# EAGLE schematic CurrentMeter (EAGLE 9.4.1)
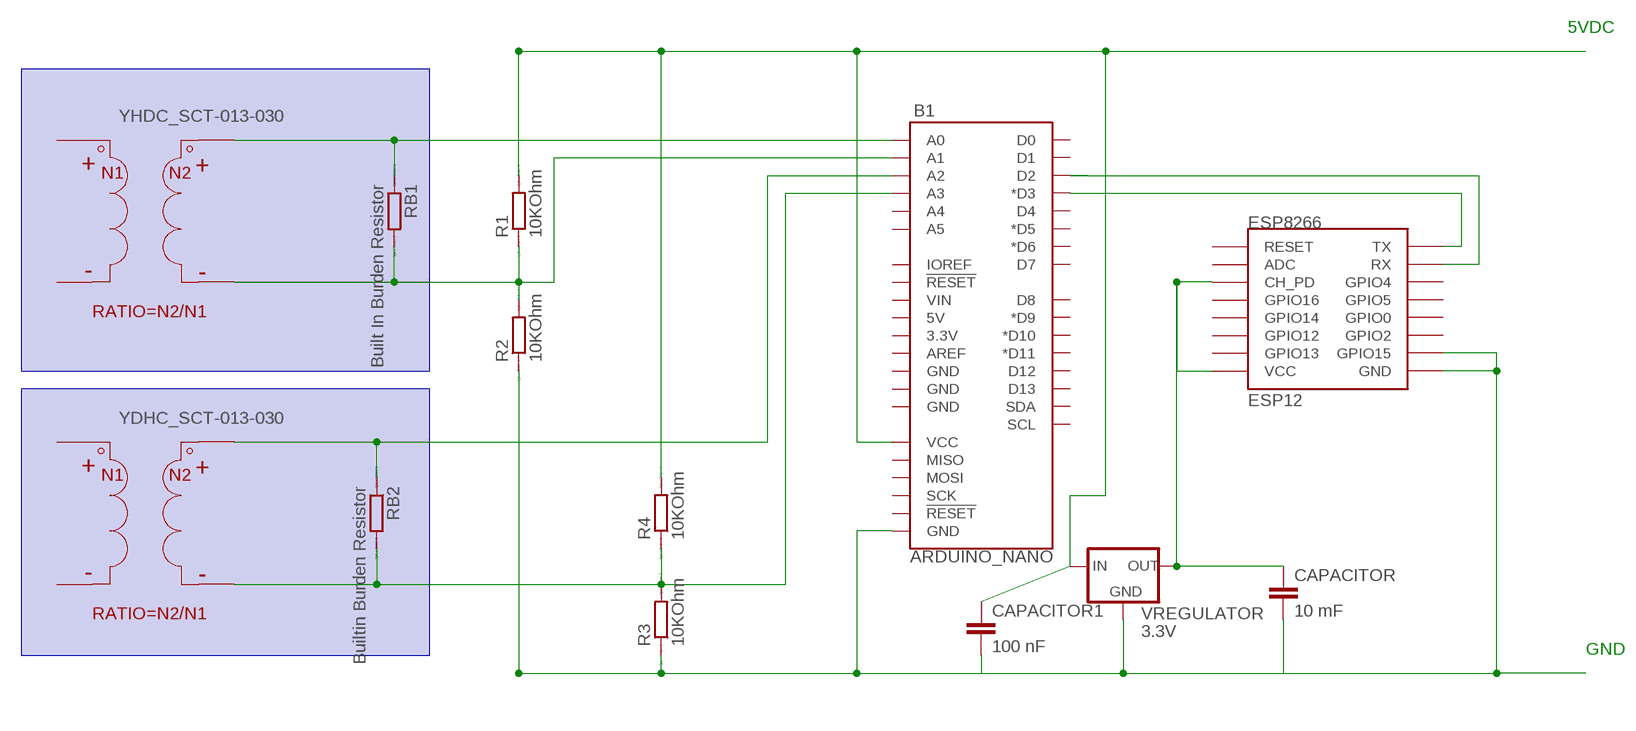
[diagram p0: schematic, sheet 1]

## Parts
B1  ARDUINO_NANO  ARDUINO_UNO_R3  [ARDUINO_R3]
CAPACITOR  10 mF  CAPACITOR_0201_L  [RESC0201_L]
CAPACITOR1  100 nF  CAPACITOR_0201_L  [RESC0201_L]
ESP8266  ESP12  [ESP12]
R1  10KOhm  R  [R0805]
R2  10KOhm  R  [R0805]
R3  10KOhm  R  [R0805]
R4  10KOhm  R  [R0805]
RB1  Built In Burden Resistor  R  [R0805]
RB2  Builtin Burden Resistor  R  [R0805]
VREGULATOR  3.3V  78LXX  [78LXX]
YDHC_SCT-013-030  TRANSFORMER  (no package)
YHDC_SCT-013-030  TRANSFORMER  (no package)

## Nets
ESP8266: B1.D3(*D3) ESP8266.TX
N$1: B1.A0 RB1.1 YHDC_SCT-013-030.P$3
N$2: B1.A1 R1.1 R2.2 RB1.2 YHDC_SCT-013-030.P$4
N$3: B1.VCC CAPACITOR1.1 R1.2 R4.2 VREGULATOR.IN
N$4: B1.GND@1(GND) ESP8266.GND ESP8266.GPIO15 R2.1 R3.1 VREGULATOR.GND
N$5: B1.A3 R3.2 R4.1 RB2.2 YDHC_SCT-013-030.P$4
N$6: B1.A2 RB2.1 YDHC_SCT-013-030.P$3
N$7: CAPACITOR.1 ESP8266.CH_PD ESP8266.VCC VREGULATOR.OUT
N$8: B1.D2 ESP8266.RX
N$9: CAPACITOR.2
N$19: CAPACITOR1.2
Unconnected: B1.3.3V B1.5V B1.A4 B1.A5 B1.AREF B1.D0 B1.D1 B1.D4 B1.D5(*D5) B1.D6(*D6) B1.D7 B1.D8 B1.D9(*D9) B1.D10(*D10) B1.D11(*D11) B1.D12 B1.D13 B1.GND@2(GND) B1.GND@3(GND) B1.GND@4(GND) B1.IOREF B1.MISO B1.MOSI B1.RESET@1(!RESET!) B1.RESET@2(!RESET!) B1.SCK B1.SCL B1.SDA B1.VIN ESP8266.ADC ESP8266.GPIO0 ESP8266.GPIO2 ESP8266.GPIO4 ESP8266.GPIO5 ESP8266.GPIO12 ESP8266.GPIO13 ESP8266.GPIO14 ESP8266.GPIO16 ESP8266.RESET YDHC_SCT-013-030.P$1 YDHC_SCT-013-030.P$2 YHDC_SCT-013-030.P$1 YHDC_SCT-013-030.P$2

## Notes on the sheet
- 5VDC
- GND

## Library data of the parts
B1 = SparkFun-Boards:ARDUINO_UNO_R3: Arduino R3 Footprint with SPI header Arduino Uno R3 Compatible Footprint. Matches PCB size of the original board. SparkFun Products: SAMD21 Dev Breakout <https://www.sparkfun.com/products/13672> RedBoard <https://www.sparkfun.com/products/12757> R3 Stackable Headers <https://www.sparkfun.com/products/11417>
CAPACITOR CAPACITOR1 = Nordic_nRF:CAPACITOR: Generic chip capacitor
ESP8266 = esp8266modules:ESP12: ESP8266 Wifi module 12
R1-R4 RB1 RB2 = eagle-ltspice:R: RESISTOR, European symbol; SPICEMODEL: NONE; SPICEPREFIX: R
VREGULATOR = DC_LOAD_AU:78LXX: VOLTAGE REGULATOR
YDHC_SCT-013-030 YHDC_SCT-013-030 = ngspice-simulation:TRANSFORMER: Coupled inductors The RATIO is defined in the schematic by using the text command and adding a line that says: .PARAM RATIO=x Where x is the turns ratio of the transformer